# EAGLE design RAT (EAGLE 6.6.0)

## Sheet 1 of 3
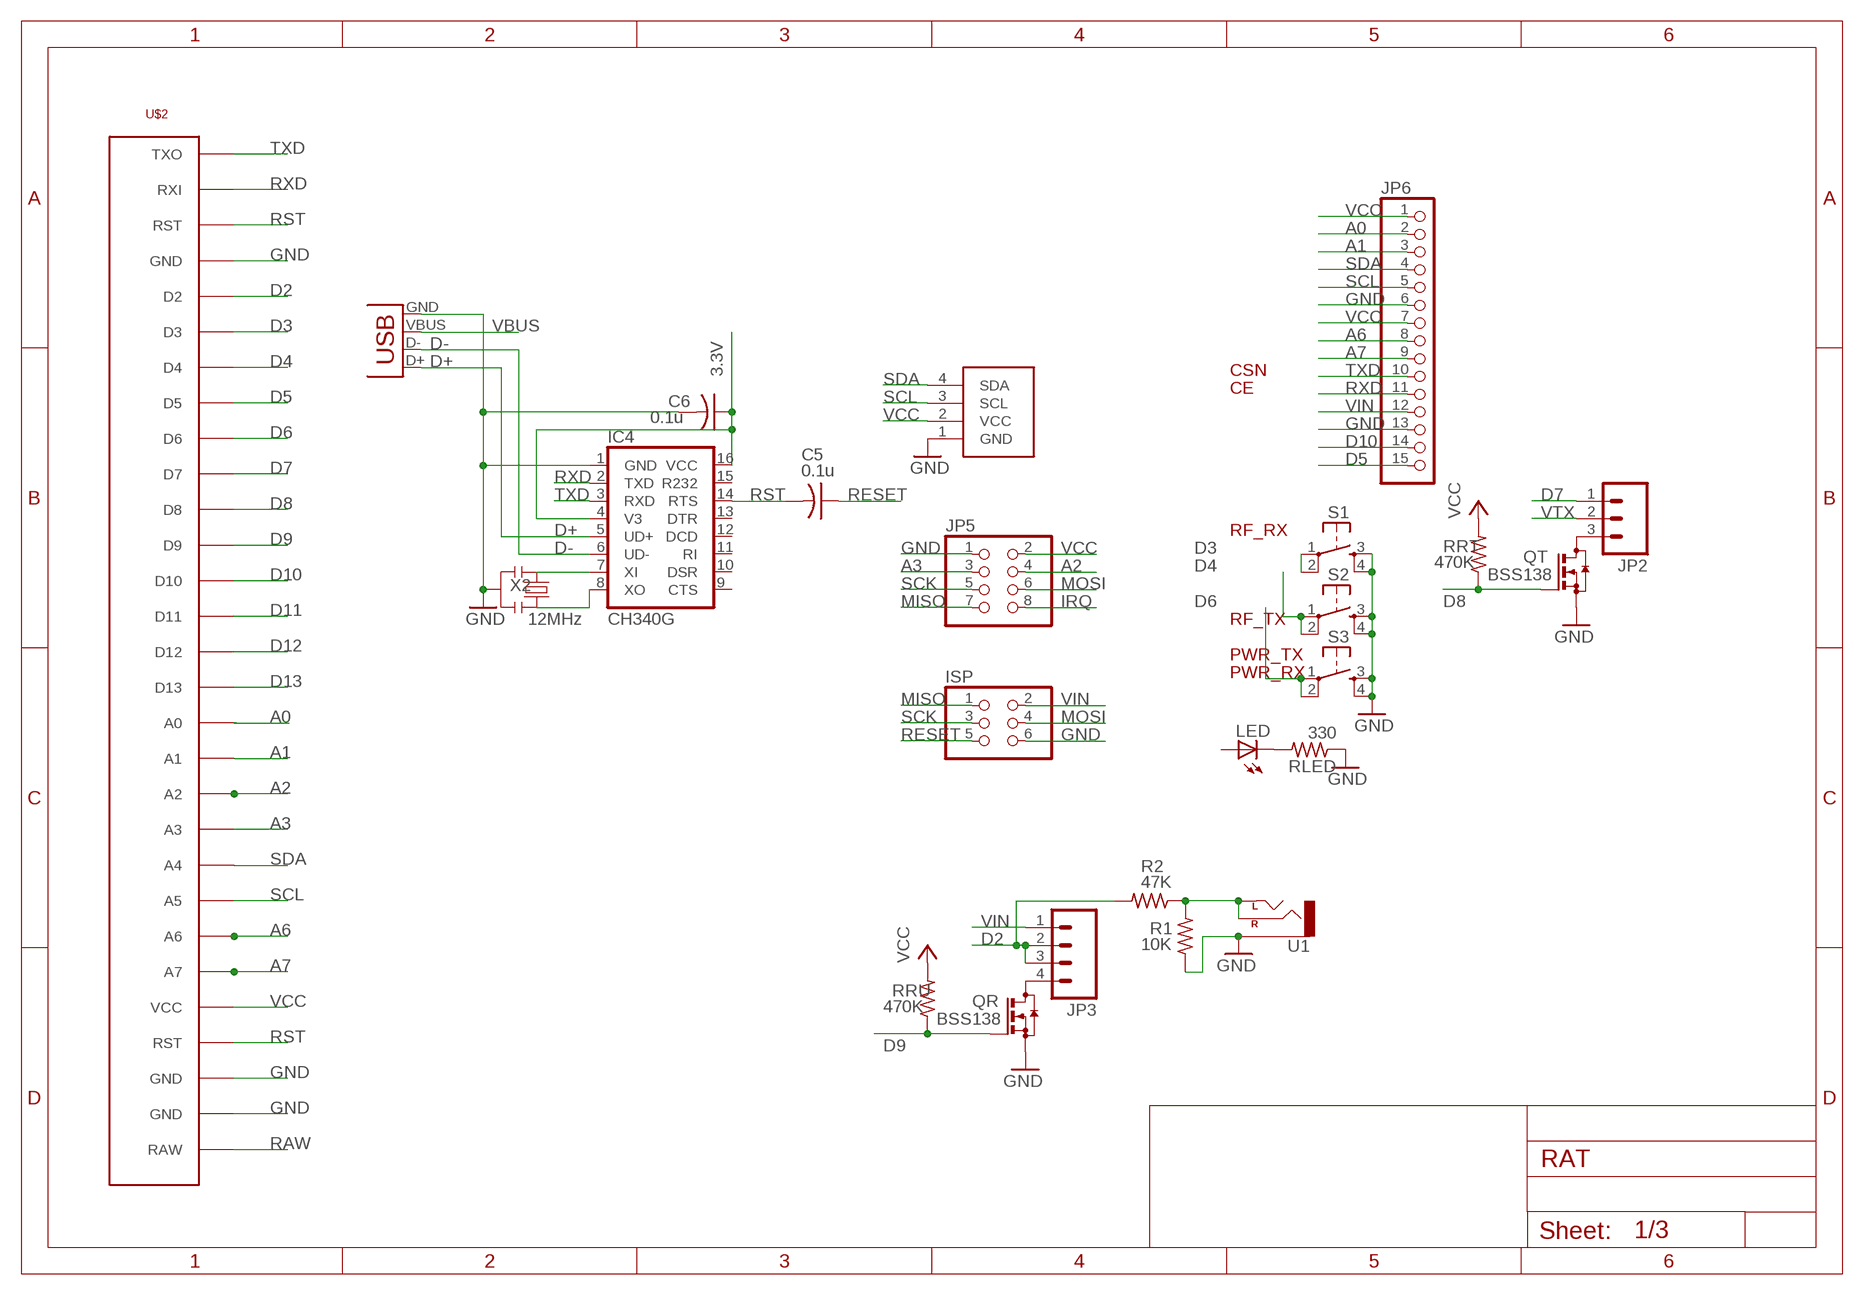
[diagram p0: schematic, sheet 1]

### Parts
C5  0.1u  C-USC0805K  [C0805K]
C6  0.1u  C-USC0805K  [C0805K]
IC4  CH340G  [SO16]
ISP  PINHD-2X3  [2X03]
JP2  M03LOCK_LONGPADS  [1X03_LOCK_LONGPADS]
JP3  M04LOCK  [1X04_LOCK]
JP5  PINHD-2X4  [2X04]
JP6  PINHD-1X15-CB  [1X15-CB]
LED  LEDCHIPLED_0805  [CHIPLED_0805]
QR  BSS138  BSS123  [SOT23]
QT  BSS138  BSS123  [SOT23]
R1  10K  R-US_R0805  [R0805]
R2  47K  R-US_R0805  [R0805]
RLED  330  R-US_R0805  [R0805]
RRT  470K  R-US_R0805  [R0805]
RRU  470K  R-US_R0805  [R0805]
S1  TAC_SWITCHPTH  [TACTILE-PTH]
S2  TAC_SWITCHPTH  [TACTILE-PTH]
S3  TAC_SWITCHPTH  [TACTILE-PTH]
U1  AUDIO-JACKPTH  [AUDIO-JACK]
U$1  SSD1306_OLED_I2C  [SSD1306_OLED_I2C]
U$2  ARDUINO-PRO-MINI-CORRECT  [ARDUINO-PRO-MINI]
X1  USBSMD  [USB-MINIB]
X2  12MHz  RESONATORSMD  [RESONATOR-SMD]

### Nets
3.3V [power]: C6.1 IC4.4(V3) IC4.16(VCC)
A0: JP6.2 U$2.A0
A1: JP6.3 U$2.A1
A2: JP5.4 U$2.A2
A3: JP5.3 U$2.A3
A6: JP6.8 U$2.A6@1(A6) U$2.A6@2(A6)
A7: JP6.9 U$2.A7@1(A7) U$2.A7@2(A7)
D2: JP3.2 JP3.3 R2.2 U$2.2(D2)
D3: S1.1 S1.2 U$2.3(D3)
D4: S2.1 S2.2 U$2.4(D4)
D5: JP6.15 U$2.5(D5)
D6: S3.1 S3.2 U$2.6(D6)
D7: JP2.1 U$2.7(D7)
D8: QT.1(G) RRT.1 U$2.8(D8)
D9: QR.1(G) RRU.1 U$2.9(D9)
D10: JP6.14 U$2.10(D10)
D11: U$2.11(D11)
D12: U$2.12(D12)
D13: U$2.13(D13)
D+: IC4.5(UD+) X1.D+
D-: IC4.6(UD-) X1.D-
GND [power]: C6.2 IC4.1(GND) ISP.6 JP5.1 JP6.6 JP6.13 QR.2(S) QT.2(S) R1.1 RLED.1 S1.3 S1.4 S2.3 S2.4 S3.3 S3.4 U1.SLEEVE U$1.1(GND) U$2.GND@1(GND) U$2.GND@2(GND) U$2.GND@3(GND) X1.GND X2.2 ; also sheet 2
IRQ: JP5.8
MISO: ISP.1 JP5.7
MOSI: ISP.4 JP5.6
N$1: LED.C RLED.2
N$4: R1.2 R2.1 U1.RING(RIGHT) U1.TIP(LEFT)
N$6: JP3.4 QR.3(D)
N$8: JP2.3 QT.3(D)
N$11: IC4.7(XI) X2.1
N$13: IC4.8(XO) X2.3
RAW: U$2.RAW
RESET: C5.1 ISP.5
RST: C5.2 IC4.14(RTS) U$2.RST@1(RST) U$2.RST@2(RST)
RXD: IC4.2(TXD) JP6.11 U$2.RXI
SCK: ISP.3 JP5.5
SCL: JP6.5 U$1.3(SCL) U$2.A5
SDA: JP6.4 U$1.4(SDA) U$2.A4
TXD: IC4.3(RXD) JP6.10 U$2.TXO
VBUS: X1.VBUS ; also sheet 2
VCC: JP5.2 JP6.1 JP6.7 RRT.2 RRU.2 U$1.2(VCC) U$2.VCC ; also sheet 2
VIN [power]: ISP.2 JP3.1 JP6.12
VTX [power]: JP2.2 ; also sheet 2
Unconnected: IC4.9(CTS) IC4.10(DSR) IC4.11(RI) IC4.12(DCD) IC4.13(DTR) IC4.15(R232) LED.A

### Notes on the sheet
- CSN
- CE
- RF_RX
- RF_TX
- PWR_TX
- PWR_RX

## Sheet 2 of 3
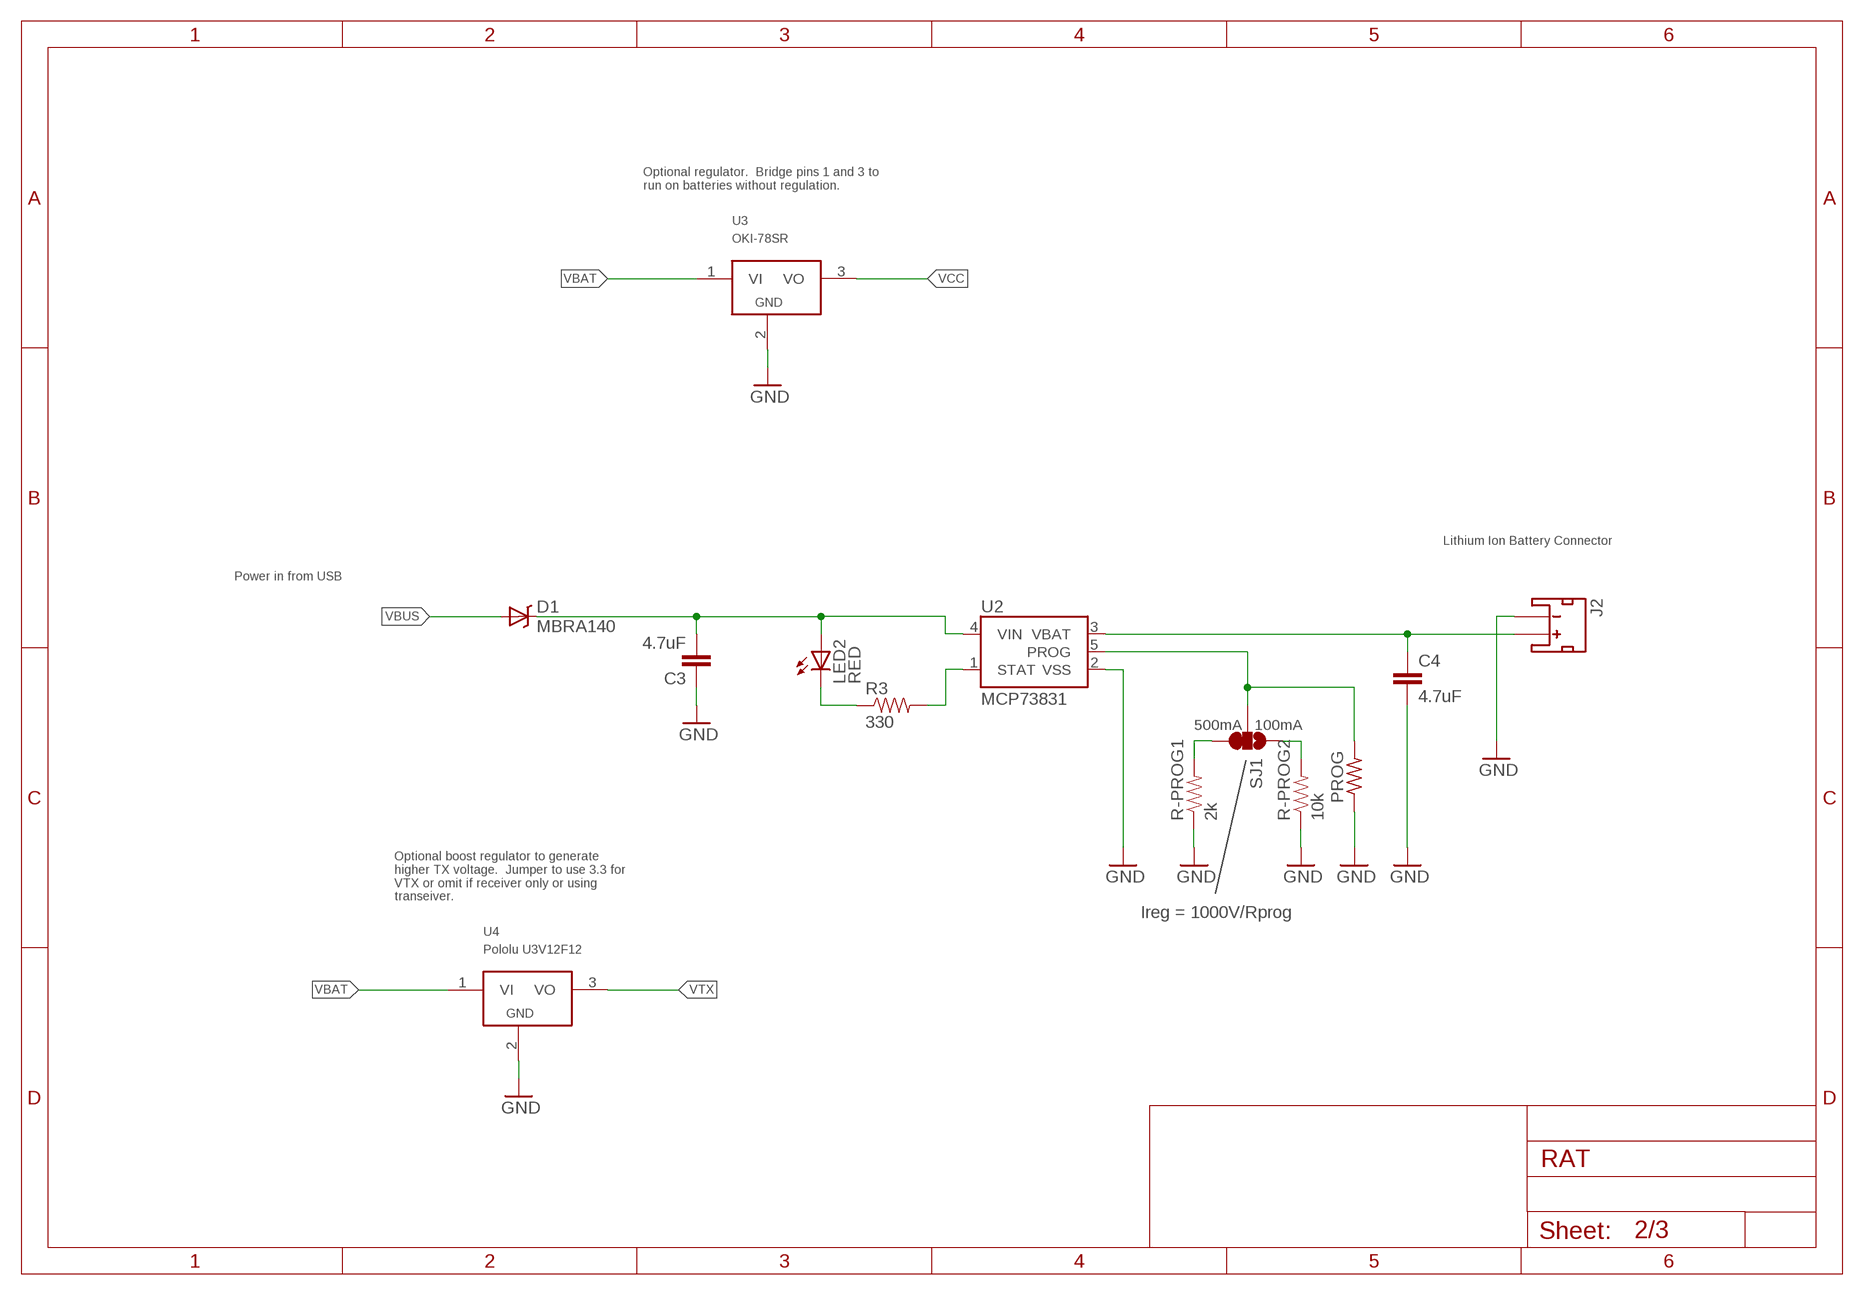
[diagram p1: schematic, sheet 2]

### Parts
C3  4.7uF  4.7UF-6.3V-10%(0603)0603  [0603-CAP]
C4  4.7uF  4.7UF-6.3V-10%(0603)0603  [0603-CAP]
D1  MBRA140  [SMA-DIODE]
J2  JST_2MM_MALE  [JST-2-SMD]
LED2  RED  LED-RED0603  [LED-0603]
PROG  R-US_R0603  [R0603]
R3  330  330OHM1/10W1%(0603)  [0603-RES]
R-PROG1  2k  2.0KOHM1/10W5%(0603)  [0603-RES]
R-PROG2  10k  10KOHM1/10W1%(0603)0603  [0603-RES]
SJ1  SOLDERJUMPER_2WAYS  [SJ_3]
U2  MCP73831  [SOT23-5]
U3  OKI-78SR  [TO-220]
U4  Pololu U3V12F12  OKI-78SR  [TO-220]

### Nets
GND [power]: C3.1 C4.2 J2.1(-) PROG.1 R-PROG1.1 R-PROG2.1 U2.2(VSS) U3.2(GND) U4.2(GND) ; also sheet 1
N$3: R-PROG1.2 SJ1.3
N$5: R3.2 U2.1(STAT)
N$7: R-PROG2.2 SJ1.1
N$10: LED2.C R3.1
PROG: PROG.2 SJ1.2 U2.5(PROG)
VBAT [power]: C4.1 J2.2(+) U2.3(VBAT) U3.1(VI) U4.1(VI)
VBUS: D1.A ; also sheet 1
VBUS_DIODE [power]: C3.2 D1.C LED2.A U2.4(VIN)
VCC: U3.3(VO) ; also sheet 1
VTX [power]: U4.3(VO) ; also sheet 1
Unconnected: J2.NC1(PAD1) J2.NC2(PAD2)

### Notes on the sheet
- Optional regulator.  Bridge pins 1 and 3 to 
  run on batteries without regulation.
- Lithium Ion Battery Connector
- Power in from USB
- 500mA | 100mA
- Optional boost regulator to generate
  higher TX voltage.  Jumper to use 3.3 for
  VTX or omit if receiver only or using
  transeiver.
- Ireg = 1000V/Rprog

## Sheet 3 of 3

## Library data of the parts
C3 C4 = SparkFun-Capacitors:4.7UF-6.3V-10%(0603): CAP-08280; PROD_ID: CAP-08280
C5 C6 = adafruit:C-US: CAPACITOR, American symbol
D1 = SparkFun-DiscreteSemi:MBRA140: 40V, 1A Schottky rectifier SMA/DO-214AC package DIO-08053; PROD_ID: DIO-08053
IC4 = SparkFunNew:CH340
ISP = pinhead:PINHD-2X3: PIN HEADER
J2 = SparkFun-Connectors:JST_2MM_MALE: Mates to single-cell LiPo batteries. CONN-08352; PROD_ID: CONN-08352
JP2 = SparkFun:M03: Header 3 Standard 3-pin 0.1" header. Use with straight break away headers (SKU : PRT-00116), right angle break away headers (PRT-00553), swiss pins (PRT-00743), machine pins (PRT-00117), and female headers (PRT-00115). Molex polarized connector foot print use with SKU : PRT-08232 with associated crimp pins and housings.
JP3 = SparkFun:M04: Header 4 Standard 4-pin 0.1" header. Use with straight break away headers (SKU : PRT-00116), right angle break away headers (PRT-00553), swiss pins (PRT-00743), machine pins (PRT-00117), and female headers (PRT-00115). Molex polarized connector foot print use with SKU : PRT-08231 with associated crimp pins and housings.
JP5 = adafruit2013:PINHD-2X4: PIN HEADER
JP6 = adafruit2013:PINHD-1X15: PIN HEADER
LED = adafruit:LED: LED OSRAM: - CHIPLED LG R971, LG N971, LY N971, LG Q971, LY Q971, LO R971, LY R971 LH N974, LH R974 LS Q976, LO Q976, LY Q976 LO Q996 - Hyper CHIPLED LW Q18S LB Q993, LB Q99A, LB R99A - SideLED LS A670, LO A670, LY A670, LG A670, LP A670 LB A673, LV A673, LT A673, LW A673 LH A674 LY A675 LS A676, LA A676, LO A676, LY A676, LW A676 LS A679, LY A679, LG A679 - Hyper Micro SIDELED® LS Y876, LA Y876, LO Y876, LY Y876 LT Y87S - SmartLED LW L88C, LW L88S LB L89C, LB L89S, LG L890 LS L89K, LO L89K, LY L89K LS L896, LA L896, LO L896, LY L896 - TOPLED LS T670, LO T670, LY T670, LG T670, LP T670 LSG T670, LSP T670, LSY T670, LOP T670, LYG T670 LG T671, LOG T671, LSG T671 LB T673, LV T673, LT T673, LW T673 LH T674 LS T676, LA T676, LO T676, LY T676, LB T676, LH T676, LSB T676, LW T676 LB T67C, LV T67C, LT T67C, LS T67K, LO T67K, LY T67K, LW E67C LS E67B, LA E67B, LO E67B, LY E67B, LB E67C, LV E67C, LT E67C LW T67C LS T679, LY T679, LG T679 LS T770, LO T770, LY T770, LG T770, LP T770 LB T773, LV T773, LT T773, LW T773 LH T774 LS E675, LA E675, LY E675, LS T675 LS T776, LA T776, LO T776, LY T776, LB T776 LHGB T686 LT T68C, LB T68C - Hyper Mini TOPLED® LB M676 - Mini TOPLED Santana® LG M470 LS M47K, LO M47K, LY M47K Source: http://www.osram.convergy.de/
LED2 = SparkFun-LED:LED-RED: Assorted Red LEDs LilyPad 1206- DIO-09912 1206- DIO-00809 0603- DIO-00819; PROD_ID: DIO-00819
PROG = rcl:R-US_: RESISTOR, American symbol
QR QT = transistor-small-signal:BSS123: N-CHANNEL MOS FET
R1 R2 RLED RRT RRU = adafruit2013:R-US_: RESISTOR, American symbol
R3 = SparkFun-Resistors:330OHM1/10W1%(0603): RES-00818; PROD_ID: RES-00818
R-PROG1 = SparkFun-Resistors:2.0KOHM1/10W5%(0603): RES-08296; PROD_ID: RES-08296; VALUE: 2.0k
R-PROG2 = SparkFun-Resistors:10KOHM1/10W1%(0603): RES-00824; PROD_ID: RES-00824; VALUE: 10K
S1-S3 = SparkFunNew:TAC_SWITCH: Momentary Switch Button commonly used for reset or general input. Spark Fun Electronics SKU : COM-00097
SJ1 = SparkFun:SOLDERJUMPER_2WAY: Solder Jumper 2 way solder jumper
U1 = SparkFunNew:AUDIO-JACK: 3.5mm Audio Jack Simple 3.5mm common PCB mount audio jack. SKU: PRT-08032
U2 = SparkFun-PowerIC:MCP73831: Miniature single cell, fully integrated Li-Ion, Li-polymer charge management controller http://ww1.microchip.com/downloads/en/DeviceDoc/21984a.pdf IC-09995; PROD_ID: IC-09995
U3 U4 = murata-regulator:OKI-78SR: Murata switching regulator in a TO-220 package. Replacement for some linear regulators. Available in 3.3 and 5 volt versions. Take up to 36 volts in. Supplyies 1.5 Amps. http://www.digikey.com/product-search/en?KeyWords=OKI-78SR&WT.z_header=search_go
U$1 = adafruit2013:SSD1306_OLED_I2C
U$2 = Arduinos:ARDUINO-PRO-MINI-CORRECT: Socket for Arduino mini pro daughter card
X1 = SparkFun:USB: USB Connectors USB-B-PTH is fully proven SKU : PRT-00139 USB-miniB is fully proven SKU : PRT-00587 USB-A-PCB is untested. USB-A-H is throughly reviewed, but untested. Spark Fun Electronics SKU : PRT-00437 USB-B-SMT is throughly reviewed, but untested. Needs silkscreen touching up. USB-A-S has not been used/tested USB-MB-H has not been used/tested
X2 = SparkFunNew:RESONATOR: Resonator Small SMD resonator. This is the itty bitty 10/20MHz resonators with built in caps. CSTCE10M0G55 and CSTCE20M0V53. Footprint has been reviewed closely but hasn't been tested yet.

## Net classes
1 power: width 0.203 mm, clearance 0.203 mm

## Board
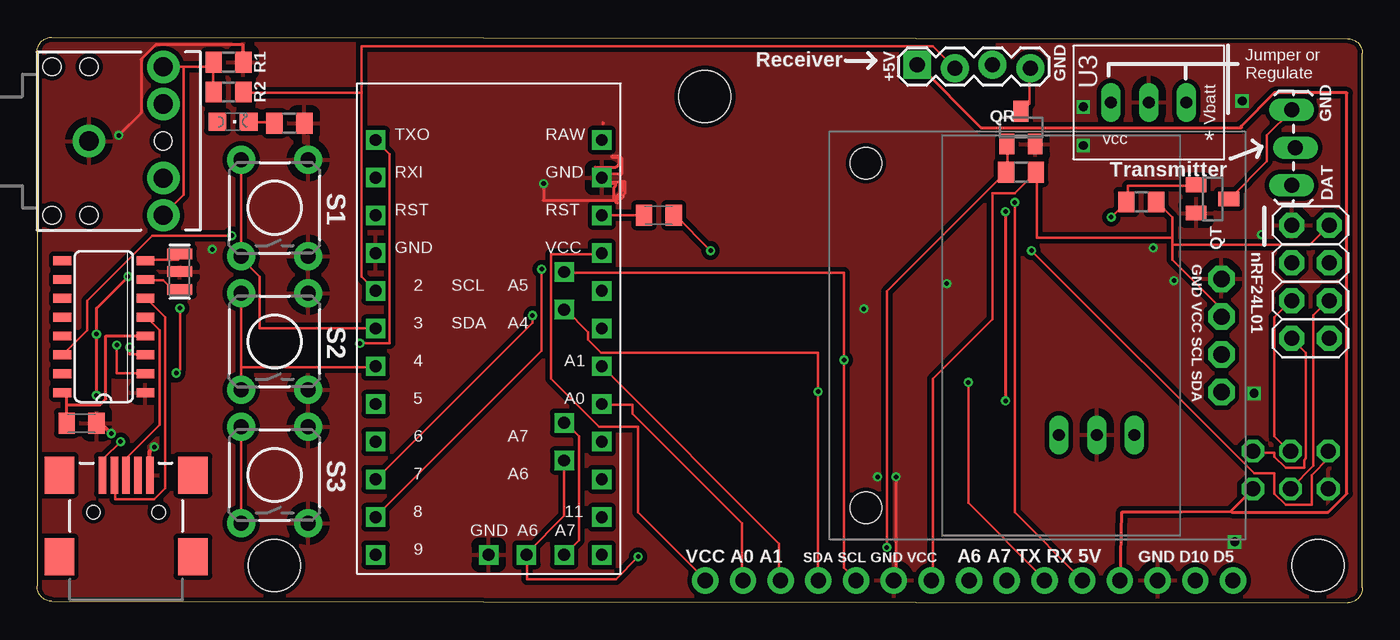
[diagram p2: board, top side]
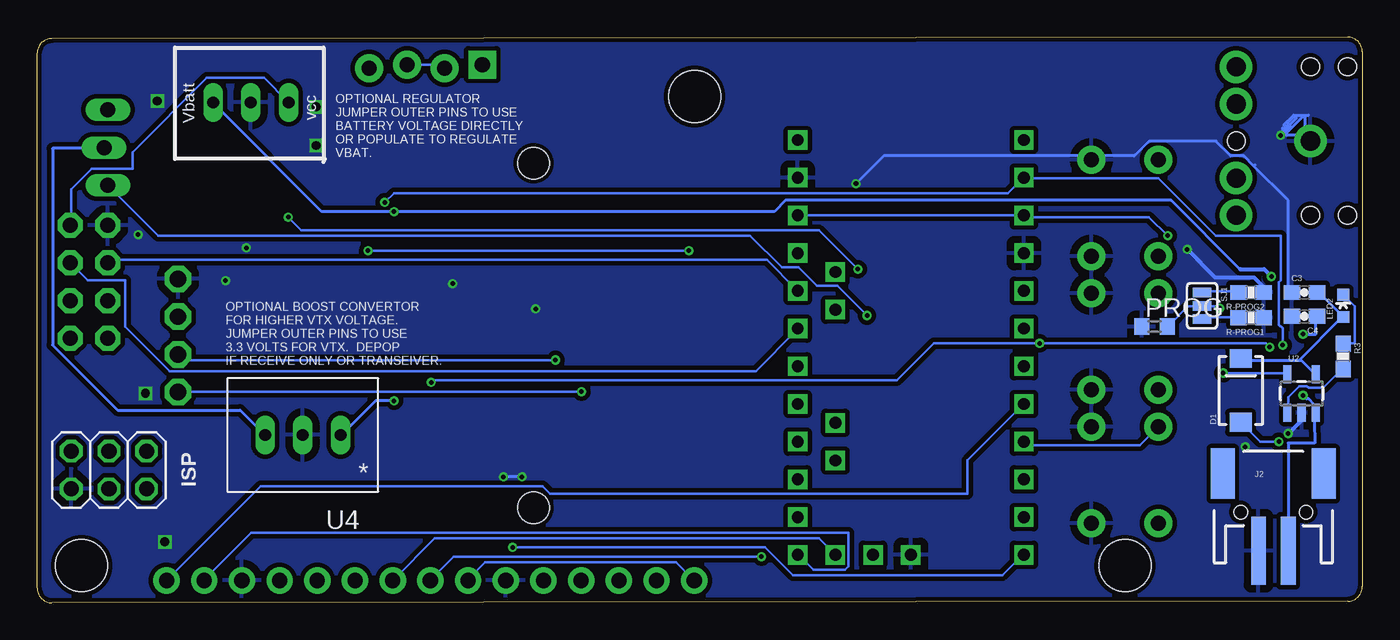
[diagram p3: board, bottom side, seen from below]

Size 89.3 x 38.1 mm. Coordinates in mm from the lower left corner, seen from the top.
Outline: 0,37.1 0,1.1 arc90 1,0.1 88.3,0 arc90 89.3,1 89.3,37 arc90 88.3,38 1,38.1 arc90 0,37.1
Copper layers (1*16): Top 0.035mm / dielectric 1.5mm / Bottom 0.035mm
Design rules "Fusion_eagle_rule_v1.1 *": minimum track width 6mil, minimum drill 12mil, track to track 6mil, track to pad 6mil, pad to pad 6mil, via to via 6mil, smd to smd 0mil, copper to edge 10mil, drill to drill 10mil, minimum pad ring 10mil, minimum via ring 6mil, stop-mask expansion 2mil, vias tented up to drill 100mil, thermal gap 20mil
Holes 3.5 mm at 45,34.1 86.3,2.5 16,2.5
vRestrict: area 81.8,17.8 to 82.6,23.6; area 86.5,27.1 to 87.3,29.2; area 86.4,32.4 to 87.2,34.5; area 68.5,35.1 to 69.3,37.2; area 57,35.1 to 57.8,37.2

### Footprints (pad centres in the part's own frame; a part is rotated, then mirrored left to right if it is on the bottom)
0603-CAP = smd 1.1 x 1: 1 -0.85,0; 2 0.85,0
C0805K = smd 1.1 x 1.4: 1 -1,0; 2 1,0
SMA-DIODE = smd 1.27 x 1.47: A -2.15,0; C 2.15,0
SO16 = smd 0.6 x 1.2: 1 -4.445,-2.8; 2 -3.175,-2.8; 3 -1.905,-2.8; 4 -0.635,-2.8; 5 0.635,-2.8; 6 1.905,-2.8; 7 3.175,-2.8; 8 4.445,-2.8; 9 4.445,2.8; 10 3.175,2.8; 11 1.905,2.8; 12 0.635,2.8; 13 -0.635,2.8; 14 -1.905,2.8; 15 -3.175,2.8; 16 -4.445,2.8
2X03 = drill 1.016 octagon: 1 -2.54,-1.27; 2 -2.54,1.27; 3 0,-1.27; 4 0,1.27; 5 2.54,-1.27; 6 2.54,1.27
JST-2-SMD = smd 1 x 4.6: 1 -1,-3.7; 2 1,-3.7 | smd 1.6 x 3.4: NC1 -3.4,1.5; NC2 3.4,1.5
1X03_LOCK_LONGPADS = drill 1.016 long: 1 0,0; 2 2.54,-0.254; 3 5.08,0
1X04_LOCK = drill 1.016 pad 1.88 square: 1 0,0.127 | drill 1.016 pad 1.88: 2 2.54,-0.127; 3 5.08,0.127; 4 7.62,-0.127
2X04 = drill 1.016 pad 1.676 octagon: 1 -3.81,-1.27; 2 -3.81,1.27; 3 -1.27,-1.27; 4 -1.27,1.27; 5 1.27,-1.27; 6 1.27,1.27; 7 3.81,-1.27; 8 3.81,1.27
1X15-CB = drill 1.016 pad 1.778: 1 -17.78,0; 2 -15.24,0; 3 -12.7,0; 4 -10.16,0; 5 -7.62,0; 6 -5.08,0; 7 -2.54,0; 8 0,0; 9 2.54,0; 10 5.08,0; 11 7.62,0; 12 10.16,0; 13 12.7,0; 14 15.24,0; 15 17.78,0
CHIPLED_0805 = smd 1.2 x 1.2: A 0,-1.05; C 0,1.05
LED-0603 = smd 0.8 x 0.8: A 0,-0.75; C 0,0.75
R0603 = smd 1 x 1.1: 1 -0.85,0; 2 0.85,0
SOT23 = smd 1 x 1.4: 1 -0.95,-1.1; 2 0.95,-1.1; 3 0,1.1
R0805 = smd 1.1 x 1.4: 1 -1,0; 2 1,0
0603-RES = smd 1.1 x 1: 1 -0.85,0; 2 0.85,0
TACTILE-PTH = drill 1.016 pad 1.88: 1 -3.251,2.261; 2 3.251,2.261; 3 -3.251,-2.261; 4 3.251,-2.261
SJ_3 = smd 0.635 x 1.27: 1 -0.889,0; 2 0,0; 3 0.889,0
AUDIO-JACK = drill 1.3 pad 2.184: RING 5,5; RSH 5,2.5; SLEEVE 0,0; TIP 5,-5; TSH 5,-2.5 | hole 1.2: 0,5; -2.5,5; -2.5,-5; 0,-5; 5,0
SOT23-5 = smd 0.55 x 1.2: 1 -0.95,-1.3; 2 0,-1.3; 3 0.95,-1.3; 4 0.95,1.3; 5 -0.95,1.3
TO-220 = drill 0.8 long: 1 -2.54,0; 2 0,0; 3 2.54,0
SSD1306_OLED_I2C = drill 1.1 pad 1.778 octagon: 1 -3.81,0; 2 -1.27,0; 3 1.27,0; 4 3.81,0 | hole 2.1: 11.6,-23.95; -11.6,-23.95
ARDUINO-PRO-MINI = drill 0.8 square: 2 -8.89,3.81; 3 -8.89,1.27; 4 -8.89,-1.27; 5 -8.89,-3.81; 6 -8.89,-6.35; 7 -8.89,-8.89; 8 -8.89,-11.43; 9 -8.89,-13.97; 10 6.35,-13.97; 11 6.35,-11.43; 12 6.35,-8.89; 13 6.35,-6.35; A0 6.35,-3.81; A1 6.35,-1.27; A2 6.35,1.27; A3 6.35,3.81; A4 3.81,2.54; A5 3.81,5.08; A6@1 3.81,-7.62; A6@2 1.27,-13.97; A7@1 3.81,-5.08; A7@2 3.81,-13.97; GND@1 6.35,11.43; GND@2 -1.27,-13.97; GND@3 -8.89,6.35; RAW 6.35,13.97; RST@1 -8.89,8.89; RST@2 6.35,8.89; RXI -8.89,11.43; TXO -8.89,13.97; VCC 6.35,6.35
USB-MINIB = smd 2.5 x 0.5: D+ 2.5,0; D- 2.5,0.8; GND 2.5,-1.6; ID 2.5,-0.8; VBUS 2.5,1.6 | smd 2.5 x 2: GND@1 -3,-4.5; GND@2 -3,4.5; GND@3 2.5,4.5; GND@4 2.5,-4.5 | hole 0.9: 0,2.2; 0,-2.2
RESONATOR-SMD = smd 0.7 x 1.7: 1 -1.2,0; 2 0,0; 3 1.2,0

### Placement (x,y rotation side)
C3  3.9,20.9 0 bottom
C4  3.9,19.3 180 bottom
C5  41.9,26.1 180 top
C6  3,12.1 0 top
D1  8.2,14.3 90 bottom
IC4  4.5,18.6 90 top
ISP  84.46,8.94 180 bottom
J2  6,7.2 0 bottom
JP2  84.53,28.12 90 top
JP3  59.3,36.12 0 top
JP5  85.8,21.62 270 top
JP6  62.8,1.5 0 top
LED  13.2,32.4 270 top
LED2  1.3,20 0 bottom
PROG  14,18.6 0 bottom
QR  66.3,32 0 top
QT  79.2,27.2 270 top
R1  12.9,36.4 180 top
R2  12.9,34.4 0 top
R3  1.3,16.6 270 bottom
R-PROG1  7.5,19.2 180 bottom
R-PROG2  7.5,20.9 180 bottom
RLED  17,32.3 180 top
RRT  74.4,27 0 top
RRU  66.3,29 0 top
S1  16,26.6 90 top
S2  16,17.6 90 top
S3  16,8.6 90 top
SJ1  10.8,20 270 bottom
U1  3.5,31.1 0 top
U2  4.1,14.1 0 bottom
U3  74.9,33.7 180 top
U4  71.4,11.3 180 bottom
U$1  79.8,18 270 top
U$2  31.7,17.2 0 top
X1  6,6.1 90 top
X2  9.6,22.3 90 top

### Tracks (layer width: path | path; a pad name or v marks a point on that pad's centre or on a via)
3.3V
  Top 0.203: C6.1 2,13.35 | 2,13.35 2,13.85 1.75,14.1 IC4.16 | 2,13.35 4.25,13.35 4.62,13.72 4.62,17.98 7.25,17.98 IC4.4
A0
  Top 0.152: U$2.A0 38.12,13.35 40.12,13.35 40.12,12.72 47.5,5.35 47.5,1.6 JP6.2
A1
  Top 0.152: U$2.A1 38.12,15.85 50,3.98 50,1.6 JP6.3
A2
  Bottom 0.152: U$2.A2 38.12,18.35 40.88,15.6 80.38,15.6 83.38,18.6 83.38,21.73 85.88,21.73 87,22.85 JP5.4
A3
  Bottom 0.152: U$2.A3 38.12,21.1 40.12,23.1 84.38,23.1 84.5,22.98 JP5.3
A6  (via drill 0.3)
  Top 0.152: U$2.A6@1 35.5,9.47 35.5,5.85 33,3.35 U$2.A6@2 33,3.23 33,1.6 39,1.6 v40.5,3.1
  Bottom 0.152: v40.5,3.1 61.25,3.1 62.75,1.6 JP6.8
A7
  Top 0.152: U$2.A7@2 35.62,3.35 36.5,4.22 36.5,11.22 35.62,12.1 U$2.A7@1
  Bottom 0.152: JP6.9 65.25,1.6 62.5,4.35 36.62,4.35 35.62,3.35 U$2.A7@2
D2
  Top 0.152: 21.88,34.35 14,34.35 R2.2 | 21.88,34.35 21.88,21.98 22.75,21.1 U$2.2 | 21.88,34.35 21.88,37.48 60.38,37.48 61.75,36.1 JP3.2
  Bottom 0.152: JP3.2 61.88,36.1 62,36.23 64.38,36.23 JP3.3
D3
  Top 0.152: U$2.3 22.75,18.48 15,18.48 15,21.98 13.75,23.23 S1.1 S1.2
D4
  Top 0.152: 13.75,15.85 22.75,15.85 U$2.4 | 13.75,15.85 S2.1 | 13.75,15.85 S2.2
D5
  Bottom 0.152: U$2.5 22.88,13.35 26.62,9.6 26.62,7.35 54.75,7.35 55.25,7.85 74.25,7.85 80.5,1.6 JP6.15
D6
  Top 0.152: S3.1 S3.2
  Bottom 0.152: U$2.6 22.75,10.85 22.5,10.6 15,10.6 S3.2
D7  (via drill 0.3)
  Top 0.152: v33.38,19.35 33.38,18.85 22.88,8.35 U$2.7
  Bottom 0.152: v33.38,19.35 35.38,21.35 36.75,21.35 38,22.6 39.12,22.6 41.25,24.73 81.12,24.73 84.5,28.1 JP2.1
D8  (via drill 0.3)
  Top 0.152: v34,22.48 34,16.98 22.88,5.85 U$2.8 | v72.38,25.98 RRT.1 73.5,27.1 73.5,28.1 78,28.1 QT.1
  Bottom 0.152: v34,22.48 36.62,25.1 71.5,25.1 v72.38,25.98
D9  (via drill 0.3)
  Top 0.152: QR.1 65.38,30.85 65.38,29.1 RRU.1 65.25,28.98 57.25,20.98 v57.25,3.73
  Bottom 0.152: v57.25,3.73 40.25,3.73 38.38,1.85 24.25,1.85 22.88,3.23 U$2.9
D10
  Bottom 0.152: U$2.10 38,3.23 37,2.23 34.88,2.23 34.62,2.48 34.62,4.72 74.88,4.72 78,1.6 JP6.14
D+
  Top 0.152: X1.D+ 6,9.72 8.25,11.97 8.25,18.35 7.38,19.23 IC4.5
D-
  Top 0.152: IC4.6 7.38,20.48 8.62,19.23 8.62,7.72 7.88,6.97 5.25,6.97 5.25,8.6 X1.D-
GND  (via drill 0.3, 0.6)
  Top 0.203: v57.88,8.47 57.88,1.73 57.75,1.6 JP6.6 | 38.12,32.35 38.12,32.26 | v34.12,28.23 34.12,27.1 38.88,27.1 38.88,27.98 39,28.1 39,28.23 38,28.23 38,28.1 37.88,28.1 37.62,28.35 37.62,29.35 39,29.35 39.25,29.6 39.25,29.98 38.75,29.98 38.75,30.1 39.25,30.1 39.38,29.98 39.38,28.85 38.25,28.85 38.25,29.23 38,29.23 37.75,28.98 37.75,28.35 39.25,28.35 39.25,27.73 39.38,27.6 39.12,27.35 39.12,27.23 39.38,27.23 39.5,27.35 39.5,27.48 39.62,27.6 39.62,28.35 39.38,28.35 39.38,27.73 39,27.35 39,26.98 39.12,26.98 39.14,26.91 | v5.5,31.48 7,32.98 7,36.6 8,37.6 13.88,37.6 13.88,36.48 R1.1 | JP5.1 84.5,25.48 84.4,25.56
  Top 0.254: X1.GND 7.6,10.2 v7.9,10.5 | C6.2 4.3,12.1 v5,11.4
  Bottom 0.203: v56.62,8.47 v57.88,8.47 | v34.12,28.23 32.25,30.1 15.38,30.1 14.38,31.1 9.88,31.1 8.88,30.1 8,30.1 7.31,29.41 | 7.31,29.41 5,27.1 5,21.23 4.38,21.23 4.12,20.98 4.12,20.85 4.5,20.85 4.75,21.1 5.12,21.1 5.12,20.98 4.88,20.98 4.75,20.85 4.75,20.78 | 3.63,32.85 4.62,32.85 5.25,32.23 5.25,32.1 5,32.1 4.5,32.6 4.5,32.73 4.62,32.73 5,32.35 5,32.23 4.88,32.1 5,31.98 5.38,31.98 5.38,31.85 5.12,31.85 5.12,31.73 5.5,31.73 5.5,31.6 5.25,31.6 5.12,31.48 3.88,31.48 3.88,32.73 4,32.73 5.25,31.48 v5.5,31.48 | 7.24,29.49 7.25,29.48 7.31,29.41
  Bottom 0.254: R-PROG2.1 6.65,21.25 7.3,21.9 9.9,21.9 v11.8,23.8 | U2.2 4.1,12.3 v5,11.4
  Bottom 0.406: v7.9,10.5 7.9,10.4
  other vias: 80.7,4.1 81.2,33.8 70.5,30.8 82.5,24.8 70.5,33.4 82,14.1 76.6,21.7 75.2,23.9 61.3,21.5 55.7,19.8
  pour Top (isolate 0.305): 0,38.1 89.3,38 89.3,0 0,0.1
  pour Bottom (isolate 0.305): 0,38.1 89.3,38 89.3,0 0,0.1
MISO
  Top 0.152: ISP.1 82,10.1 83.38,10.1 83.38,9.85 84.12,9.1 85.38,9.1 85.38,9.6 85.5,9.72 85.5,16.85 84.62,17.73 JP5.7
MOSI
  Top 0.152: ISP.4 84.5,7.72 86,9.22 86,19.35 87,20.35 JP5.6
N$1
  Top 0.152: LED.C 14.25,32.35 16,32.35 RLED.2
N$3
  Bottom 0.152: R-PROG1.2 8.38,19.23 10.75,19.23 SJ1.3
N$4
  Top 0.152: 11.88,36.1 11.88,36.35 R1.2 11.88,36.1 | 11.88,36.1 11.88,34.48 R2.1 | U1.RING 9.88,36.1 | 9.88,36.1 11.88,36.1 | U1.TIP 9.88,27.48 9.88,36.1
N$5
  Bottom 0.152: R3.2 1.38,15.72 2.62,14.47 3.62,14.47 3.75,14.6 4.25,14.6 5,13.85 5,12.85 U2.1
N$6
  Top 0.152: QR.3 66.38,33.1 66.88,33.6 66.88,35.98 JP3.4
N$7
  Bottom 0.152: R-PROG2.2 8.38,20.98 10.75,20.98 SJ1.1
N$8
  Top 0.152: QT.3 80.38,27.23 82.88,29.73 82.88,31.48 84.5,33.1 JP2.3
N$10
  Bottom 0.152: LED2.C 1.25,20.73 0.5,19.98 0.5,17.48 1.25,17.48 R3.1
N$11
  Top 0.152: X2.1 9.12,21.1 8.5,21.73 7.38,21.73 IC4.7
N$13
  Top 0.152: IC4.8 7.38,23.1 9.5,23.1 9.5,23.48 X2.3
PROG  (via drill 0.3)
  Top 0.152: v9.38,15.47 9.62,15.72 v9.62,19.85
  Bottom 0.152: v9.38,15.47 5.12,15.47 U2.5 | v9.62,19.85 9.75,19.98 10.75,19.98 SJ1.2 10.88,19.98 11.75,19.98 13.12,18.6 PROG.2
RESET  (via drill 0.3)
  Top 0.152: v45.38,23.73 43,26.1 C5.1 | v67,23.73 82,8.72 83.38,8.72 83.38,7.35 84.12,6.6 85.88,6.6 85.88,8.6 87,9.72 ISP.5
  Bottom 0.152: v67,23.73 v45.38,23.73
RST  (via drill 0.3)
  Top 0.152: C5.2 38.12,26.1 U$2.RST@2 | v13.12,24.73 7.75,24.73 3.38,20.35 3.38,18.35 1.75,16.73 IC4.14
  Bottom 0.152: v13.12,24.73 14.38,25.98 22.75,25.98 U$2.RST@1 22.88,26.1 38,26.1 U$2.RST@2
RXD  (via drill 0.3)
  Top 0.152: v5.38,17.35 5.38,15.47 7.25,15.47 IC4.2 | v65.88,26.98 65.88,6.1 70.38,1.6 JP6.11
  Bottom 0.152: v5.38,17.35 5.38,18.48 5.62,18.73 5.62,21.6 5.5,21.73 5.5,24.73 9.88,24.73 13.75,28.6 22.75,28.6 U$2.RXI 22.88,28.6 23.88,27.6 65.25,27.6 v65.88,26.98
SCK
  Top 0.152: ISP.3 84.38,10.22 83.38,11.22 83.38,19.23 84.5,20.35 JP5.5
SCL  (via drill 0.3)
  Top 0.152: U$2.A5 35.62,22.23 54.38,22.23 v54.38,16.35 54.38,2.35 55.12,1.6 JP6.5
  Bottom 0.152: v54.38,16.35 79.38,16.35 79.75,16.73 U$1.3
SDA  (via drill 0.3)
  Top 0.152: U$2.A4 35.62,19.73 37.12,18.23 37.12,17.73 38,16.85 52.62,16.85 v52.62,14.22 52.62,1.6 JP6.4
  Bottom 0.152: v52.62,14.22 79.75,14.22 U$1.4
TXD  (via drill 0.3)
  Top 0.152: v6.25,17.23 6.25,16.73 7.25,16.73 IC4.3 | v21.75,17.48 23.75,17.48 23.75,30.23 22.88,31.1 U$2.TXO | v62.75,14.85 62.75,6.72 67.88,1.6 JP6.10
  Bottom 0.152: v6.25,17.23 6.5,17.48 v21.75,17.48 28.88,17.48 31.38,14.97 62.62,14.97 v62.75,14.85
VBAT  (via drill 0.3)
  Top 0.203: v4,13.97 v4,18.1 4,19.85 v6.12,21.98 | v65.25,26.35 v65.25,13.6
  Bottom 0.203: v4,18.1 3.12,18.1 3.12,19.23 C4.1 | v4,13.97 3.75,13.72 3.62,13.72 3.25,13.35 3.25,12.85 U2.3 3.25,12.72 3.25,12.22 3.23,10.75 5,10.75 J2.2 | 8.25,22.48 12.88,27.1 38.88,27.1 39.62,26.35 v65.25,26.35 70.12,26.35 77.38,33.6 U3.1 | v65.25,13.6 66.5,13.6 68.75,11.35 U4.1
  Bottom 0.254: 8.25,22.48 6.62,22.48 v6.12,21.98
VBUS  (via drill 0.3)
  Top 0.152: v5.62,10.85 4.5,9.72 4.5,8.6 X1.VBUS
  Bottom 0.152: v5.62,10.85 6.88,10.85 8.12,12.1 D1.A
VBUS_DIODE
  Bottom 0.203: C3.2 3,20.85 2.88,20.85 1.38,19.35 LED2.A 1.38,19.23 4.25,16.35 | 4.25,16.35 8.12,16.35 D1.C | 4.25,16.35 4.12,16.35 3.25,15.47 U2.4
VCC
  Top 0.152: U$2.VCC 38,23.48 34.62,23.48 34.62,15.1 37.88,11.85 40.5,11.85 40.5,6.1 45,1.6 JP6.1 | JP6.7 60.38,1.6 60.38,15.1 64.38,19.1 64.38,27.6 65.88,27.6 67.25,28.98 RRU.2 67.38,28.98 67.38,24.6 76.5,24.6 | 76.5,24.1 76.5,23.1 79.75,19.85 79.75,19.35 U$1.2 | 76.5,24.1 76.5,24.6 | 76.5,24.6 76.5,25.98 75.5,26.98 RRT.2 | 76.5,24.1 85.75,24.1 87,25.35 JP5.2
  Bottom 0.152: JP6.7 60.25,1.6 59.12,2.73 46.25,2.73 45.12,1.6 JP6.1 | U3.3 72.38,33.73 74,35.35 77.88,35.35 82.88,30.35 82.88,29.23 85.62,29.23 87,27.85 87,25.48 JP5.2
VIN
  Top 0.203: 80.44,6.16 77.1,6.12 73.1,6.12 73,1.6 JP6.12 | 80.44,6.16 81.88,7.6 ISP.2 | JP3.1 59.38,36.23 63.62,31.98 81.12,31.98 81.12,32.1 83.38,34.35 88.25,34.35 88.25,7.35 87,6.1 80.5,6.1 80.44,6.16
VTX
  Bottom 0.203: U4.3 74,11.35 75.62,12.97 83.88,12.97 88.25,17.35 88.25,30.6 84.88,30.6 JP2.2

### Text on the board
tPlace: Jumper or / Regulate | vcc | Vbatt
bPlace: vcc | Vbatt | OPTIONAL REGULATOR / JUMPER OUTER PINS TO USE / BATTERY VOLTAGE DIRECTLY / OR POPULATE TO REGULATE / VBAT. | OPTIONAL BOOST CONVERTOR / FOR HIGHER VTX VOLTAGE. / JUMPER OUTER PINS TO USE / 3.3 VOLTS FOR VTX. DEPOP / IF RECEIVE ONLY OR TRANSEIVER.
tNames: Receiver | +5V | GND | GND | Transmitter | DAT | nRF24L01 | VCC A0 A1 | SDA SCL GND VCC | A6 A7 TX RX 5V | GND D10 D5